# Altium project PCB_Project.PrjPcb
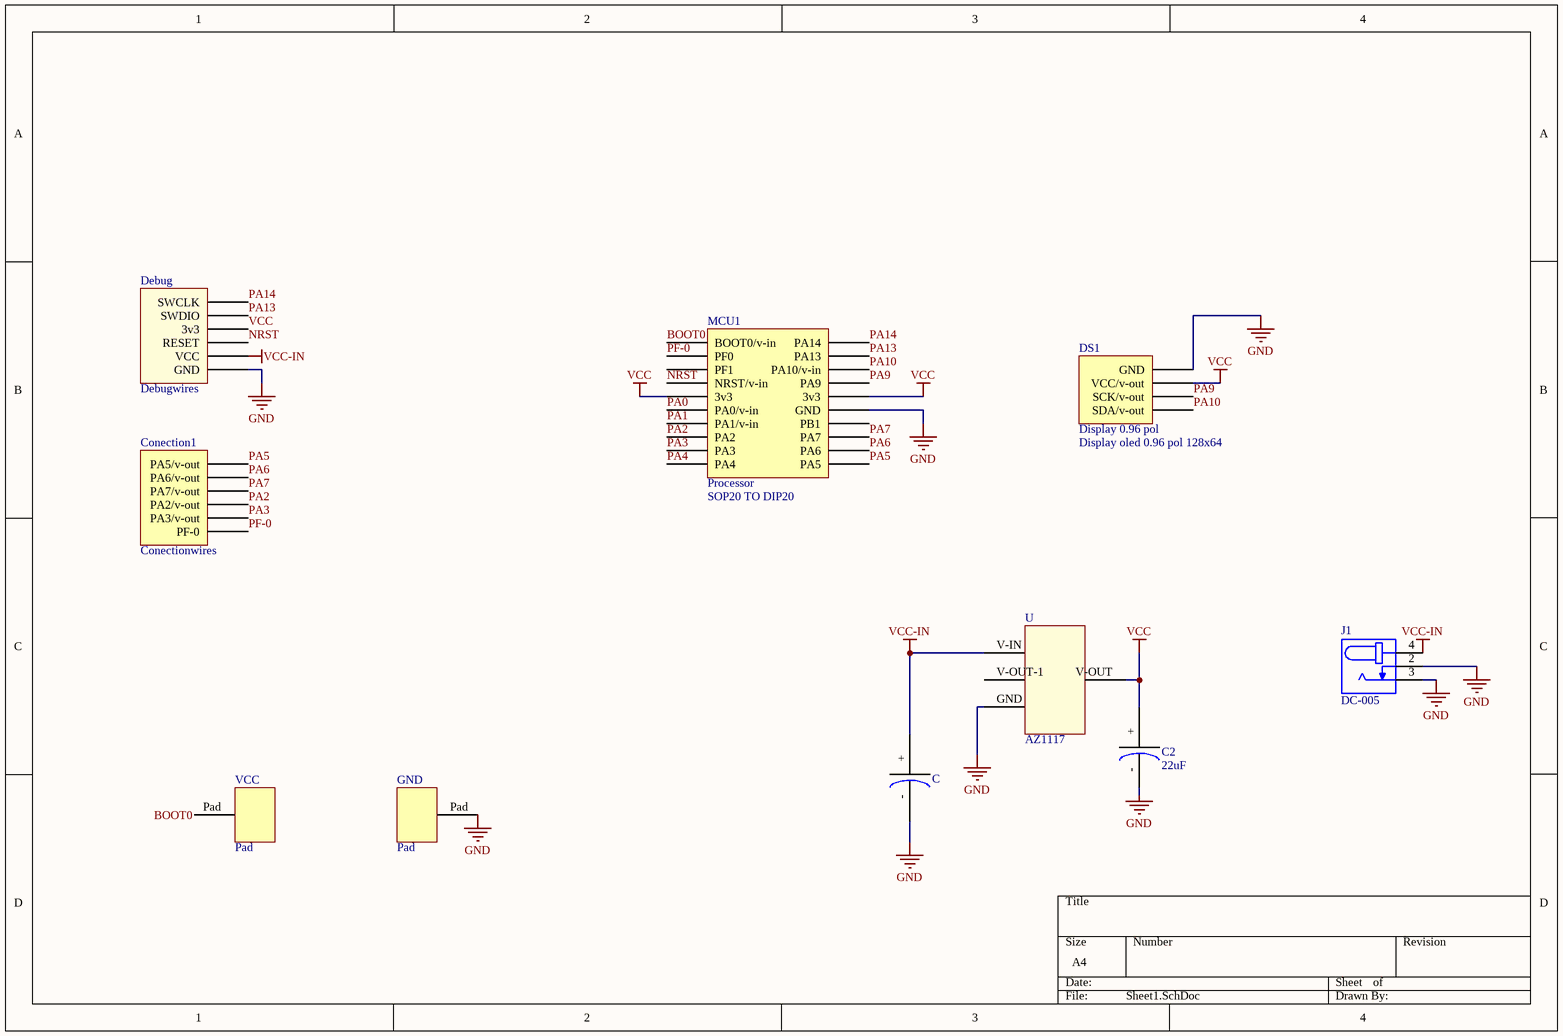
[diagram p0: Sheet1.SchDoc]
1 sheet, 10 parts. Net scope: global (net labels, ports and power ports of the same name join across sheets).
Board file: PCB1.PcbDoc

## Sheet Sheet1.SchDoc
size A4

### Parts
C  Capacitor Eletrolítico  [Capacitor]  (value not drawn)
C2  22uF  [Capacitor]
Conection1  Conectionwires  [Conectionwires]
Debug  Debugwires  [Debugwires]
DS1  Display 0.96 pol  Informations: Display oled 0.96 pol 128x64  [Display oled]
GND  Pad  [Pad]
J1  DC-005  [NINIGI_DC-005]
MCU1  Processor  Adapter: SOP20 TO DIP20  [Processor]
U  AZ1117  [AZ1117]
VCC  Pad  [Pad]

### Nets
GND: C.- C2.- Debug.GND DS1.GND GND.Pad J1.2 J1.3 MCU1.GND U.GND
VCC: C2.+ Debug.3v3 DS1.VCC(VCC/v-out) MCU1.3v3 U.V-OUT
VCC-IN: C.+ Debug.VCC J1.4 U.V-IN
BOOT0: MCU1.BOOT0(BOOT0/v-in) VCC.Pad
NRST: Debug.RESET MCU1.NRST(NRST/v-in)
PA0: MCU1.PA0(PA0/v-in)
PA1: MCU1.PA1(PA1/v-in)
PA2: Conection1.PA2(PA2/v-out) MCU1.PA2
PA3: Conection1.PA3(PA3/v-out) MCU1.PA3
PA4: MCU1.PA4
PA5: Conection1.PA5(PA5/v-out) MCU1.PA5
PA6: Conection1.PA6(PA6/v-out) MCU1.PA6
PA7: Conection1.PA7(PA7/v-out) MCU1.PA7
PA9: DS1.SCK(SCK/v-out) MCU1.PA9
PA10: DS1.SDA(SDA/v-out) MCU1.PA10(PA10/v-in)
PA13: Debug.PA13(SWDIO) MCU1.PA13
PA14: Debug.PA14(SWCLK) MCU1.PA14
PF-0: Conection1.PF-0 MCU1.PF0

Not connected (* = marked no-connect by the designer): MCU1 PB1 PF1; U V-OUT-1

### Library data of the parts
C C2 = Capacitor Eletrolítico: Value: R$: 0.70 /5 unidades; Availability: Avaliable; Link_Autocore: https://www.autocorerobotica.com.br/capacitor-eletrolitico-22uf-25v-kit-com-5-unidades; Datasheet_link: https://www.electron.com/electrolytic-capacitor-jamicon-skr220m1ed11m-p1278/
Conection1 = Conectionwires: 6 out; Dimensões: https://www.autocorerobotica.com.br/barra-de-40-pinos-femea-x5-unidades; buy: https://www.autocorerobotica.com.br/barra-pinos-macho-180
Debug = Debugwires: 2 in; buy: https://www.autocorerobotica.com.br/barra-de-40-pinos-femea-x5-unidades
DS1 = Display oled: 0.96 pol 24.7x27 cm; link to buy and measurements: https://pt.aliexpress.com/item/32896971385.html?spm=a2g0o.productlist.0.0.6ecd7bb88K6sVT&algo_pvid=5cb829e2-0bf1-4f55-8bae-71a0ff6fa1f2&algo_expid=5cb829e2-0bf1-4f55-8bae-71a0ff6fa1f2-0&btsid=0ab50f6215875744850722033e6e98&ws_ab_test=searchweb0_0,searchweb201602_,searchweb201603_; link_mercadolivre: https://produto.mercadolivre.com.br/MLB-1549862447-display-oled-096-azul-amarelo-i2c-128x64-arduino-raspberry-_JM?quantity=1#position=4&type=item&tracking_id=dc610daf-3617-4627-bdd2-8ae4acf904ab
J1 = DC-005: Polymeric PTC Resettable Fuse 15V 50mA Ih Surface Mount 0603 _1608 Metric_, Concave; MF: Littelfuse Inc.; Price: None; SnapEDA_Link: https://www.snapeda.com/parts/DC-005/Littelfuse%20Inc./view-part/2874446/?ref=snap; Value: *; MP: DC-005; Availability: Unavailable; Package: 0603 Ninigi; link_mercadolivre: https://produto.mercadolivre.com.br/MLB-1497128338-10-pecas-jack-j4-21mm-para-placa-plug-p4-arduino-_JM?quantity=1#position=1&type=item&tracking_id=8412b441-44a9-4b74-b006-990053047356
MCU1 = Processor: Processor arm Stm32f0xx; Link to buy: https://www.autocorerobotica.com.br/adaptador-sop20-ssop20-tssop20-smd-para-dip-20; Measurements link: https://alltopnotch.co.uk/product/2-x-sop20-s020-soic20-tssop20-msop20-to-dip20-adapter-board-smd-breakout/
U = AZ1117: Converter 5v to 3.3v; Fornecimento: 5 unidades dadas pelo LESC; Availability: Avaliable; Datasheet_Link: https://www.digikey.com/en/datasheets/diodes-incorporated/diodes-incorporated-az1117c; Link_to_buy: https://produto.mercadolivre.com.br/MLB-1647161150-transistor-az1117-25tre1-az1117-25-1117-25-kit-5-pecas-_JM#position=1&type=item&tracking_id=ce52b624-396d-47aa-8cab-d923e44ab95b; Price: R$ 34.00 / 50 unidades